# Altium schematic sheet Ldo.-16V5.-15V0.SchDoc
size A4
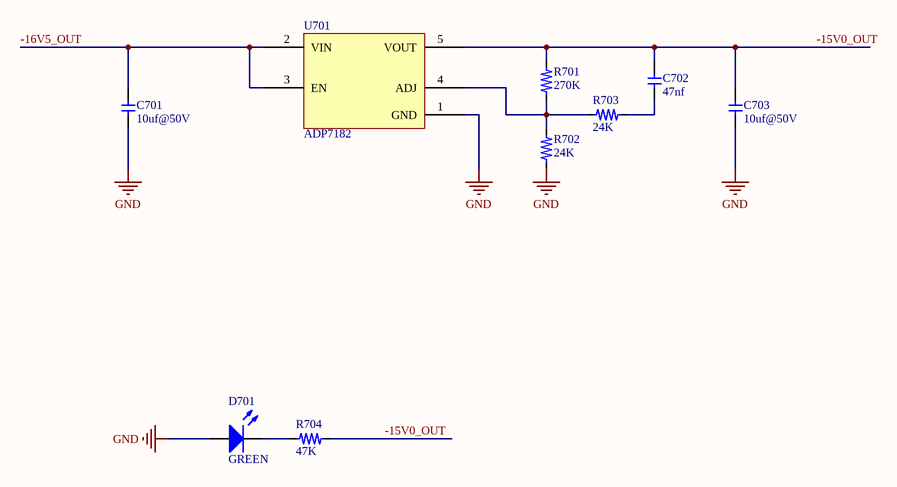
[diagram p0: Ldo.-16V5.-15V0.SchDoc]

## Parts
C701  value 10uf@50V  [C1210]  (hidden comment: Cap)
C702  value 47nf  [C0603]  (hidden comment: Cap)
C703  value 10uf@50V  [C1210]  (hidden comment: Cap)
D701  value GREEN  [LED0603]  (hidden comment: LED)
R701  value 270K  [R0603]  (hidden comment: Res)
R702  value 24K  [R0603]  (hidden comment: Res)
R703  value 24K  [R0603]  (hidden comment: Res)
R704  value 47K  [R0603]  (hidden comment: Res)
U701  ADP7182  [ADP7182-TSOT5]

## Nets
GND: C701.1 C703.1 D701.1(A) R702.1 U701.1(GND)
-15V0_OUT: C702.1 C703.2 R701.2 R704.1 U701.5(VOUT)
-16V5_OUT: C701.2 U701.2(VIN) U701.3(EN)
NetC702_2: C702.2 R703.1
NetD701_2: D701.2(K) R704.2
NetR701_1: R701.1 R702.2 R703.2 U701.4(ADJ)

## Library data of the parts
R701-R704 = Res: 电阻
U701 = ADP7182AUJ: –28 V, −200 mA, Low Noise, Linear Regulator